# Altium schematic sheet Esquemático_TP1_ASSD.SchDoc
size A4; SheetNumber: 1; SheetTotal: 2; SPICEModelCacheJDTRSODI: <root> / <DocumentId>JDTRSODI</DocumentId> / <CacheFrame Number="0"> / <Model Name="tl082" Kind="CKT"> / <Text>*TL082 / *Dual WideBW JFETInput OpAmp pkg:DIP8 (A:3,2,8,4,1)(B:5,6,8,4,7) / * Connections: / *             Non-Inverting Input / *             |   Inverting Input / *             |   |   Positive Power Supply / *             |   |   |   Negative Power Supply / *             |   |   |   |   Output / *             |   |   |   |   | / .SUBCKT TL082 1   2   3   4   5 / C1   11 12 3.498E-12 / C2    6  7 15E-12 / DC    5 53 DX / DE   54  5 DX / DLP  90 91 DX / DLN  92 90 DX / DP    4  3 DX / BGND 99  0 V=V(3)*.5 + V(4)*.5 / BB    7 99 I=I(VB)*4.715E6 - I(VC)*5E6 + I(VE)*5E6 + / +              I(VLP)*5E6 - I(VLN)*5E6 / GA    6  0 11 12 282.8E-6 / GCM   0  6 10 99 8.942E-9 / ISS   3 10 DC 195E-6 / HLIM 90  0 VLIM 1K / J1   11  2 10 JX / J2   12  1 10 JX / R2    6  9 100E3 / RD1   4 11 3.536E3 / RD2   4 12 3.536E3 / RO1   8  5 150 / RO2   7 99 150 / RP    3  4 2.143E3 / RSS  10 99 1.026E6 / VB    9  0 DC 0 / VC    3 53 DC 2.2 / VE   54  4 DC 2.2 / VLIM  7  8 DC 0 / VLP  91  0 DC 25 / VLN   0 92 DC 25 / .MODEL DX D(IS=800E-18) / .MODEL JX PJF(IS=15E-12 BETA=270.1E-6 VTO=-1) / .ENDS TL082</Text> / </Model> / </CacheFrame> / </root>
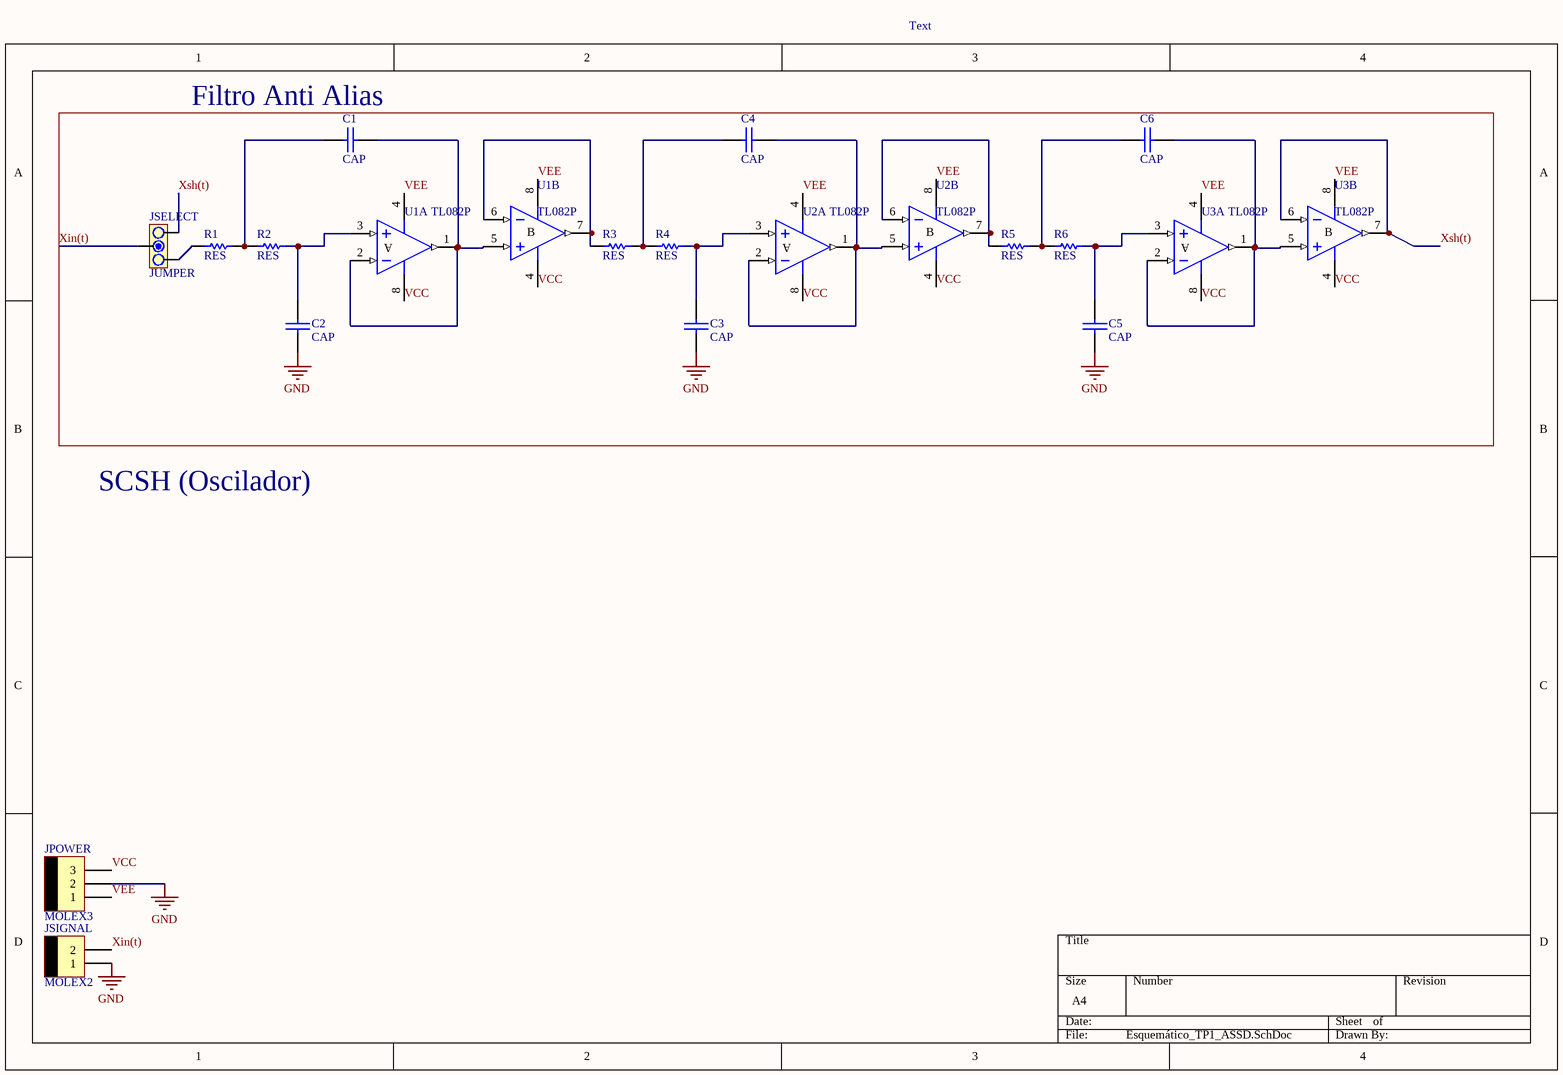
[diagram p0: Esquemático_TP1_ASSD.SchDoc]

## Parts
C1  CAP  [CAP200]
C2  CAP  [CAP200]
C3  CAP  [CAP200]
C4  CAP  [CAP200]
C5  CAP  [CAP200]
C6  CAP  [CAP200]
JPOWER  MOLEX3  [MOLEX3]
JSELECT  JUMPER  [JUMPER3]
JSIGNAL  MOLEX2  [MOLEX2]
R1  RES  [RES400]
R2  RES  [RES400]
R3  RES  [RES400]
R4  RES  [RES400]
R5  RES  [RES400]
R6  RES  [RES400]
U1  TL082P  [P008]  (parts A,B of 2)
U2  TL082P  [P008]  (parts A,B of 2)
U3  TL082P  [P008]  (parts A,B of 2)

## Blocks framed on the sheet
Filtro Anti Alias: C1-C6 JSELECT R1-R6 U1-U3

## Nets
GND: C2.2 C3.2 C5.2 JPOWER.2 JSIGNAL.1
VCC: JPOWER.3 U1.4(V-) U1.8(V+) U2.4(V-) U2.8(V+) U3.4(V-) U3.8(V+)
VEE: JPOWER.1 U1.4(V-) U1.8(V+) U2.4(V-) U2.8(V+) U3.4(V-) U3.8(V+)
Xin(t): JSELECT.2 JSIGNAL.2
Xsh(t): JSELECT.1 U3.6(IN-) U3.7(OUT)
NetC1_1: C1.1 R1.2 R2.1
NetC1_2: C1.2 U1.1(OUT) U1.2(IN-) U1.5(IN+)
NetC2_1: C2.1 R2.2 U1.3(IN+)
NetC3_1: C3.1 R4.2 U2.3(IN+)
NetC4_1: C4.1 R3.2 R4.1
NetC4_2: C4.2 U2.1(OUT) U2.2(IN-) U2.5(IN+)
NetC5_1: C5.1 R6.2 U3.3(IN+)
NetC6_1: C6.1 R5.2 R6.1
NetC6_2: C6.2 U3.1(OUT) U3.2(IN-) U3.5(IN+)
NetJSELECT_3: JSELECT.3 R1.1
NetR3_1: R3.1 U1.6(IN-) U1.7(OUT)
NetR5_1: R5.1 U2.6(IN-) U2.7(OUT)

## Notes on the sheet
- Text
- SCSH (Oscilador)
- (in symbol TL082P, part A) A
- (in symbol TL082P, part B) B

## Library data of the parts
JSELECT = JUMPER3
U1-U3 = TL082P: JFET-Input Operational Amplifier; Published: 16-Jan-2001; LatestRevisionDate: 04-Mar-2005; LatestRevisionNote: Stylized 3D Model Added.; DatasheetVersion: Feb-1999; PackageVersion: Jun-1999; PackageReference: P008; Publisher: Altium Limited; PackageDescription: DIP; 8 Leads; Row Spacing 7.62 mm; Pitch 2.54 mm; Code_JEDEC: MO-001-AN; ComponentLink1Description: Manufacturer Link; ComponentLink1URL: http://www.ti.com/; ComponentLink2Description: Datasheet; ComponentLink2URL: http://www-s.ti.com/sc/ds/tl082.pdf